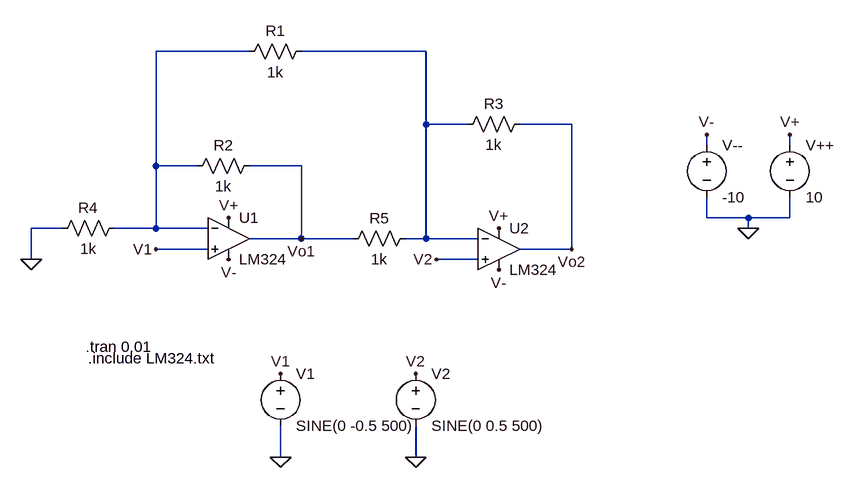
[diagram p0: schematic Lab1Circ1.asc]
Lab1Circ1.asc, the LTspice schematic file:
Version 4
SHEET 1 1424 680
WIRE 240 -128 96 -128
WIRE 512 -128 320 -128
WIRE 512 -16 512 -128
WIRE 576 -16 512 -16
WIRE 736 -16 656 -16
WIRE 944 16 944 0
WIRE 1072 16 1072 0
WIRE 96 48 96 -128
WIRE 160 48 96 48
WIRE 320 48 240 48
WIRE 944 128 944 96
WIRE 1008 128 944 128
WIRE 1072 128 1072 96
WIRE 1072 128 1008 128
WIRE -48 144 -96 144
WIRE 96 144 96 48
WIRE 96 144 32 144
WIRE 176 144 96 144
WIRE 1008 144 1008 128
WIRE 320 160 320 48
WIRE 320 160 240 160
WIRE 400 160 320 160
WIRE 512 160 512 -16
WIRE 512 160 480 160
WIRE 592 160 512 160
WIRE 176 176 96 176
WIRE 736 176 736 -16
WIRE 736 176 656 176
WIRE -96 192 -96 144
WIRE 592 192 528 192
WIRE 288 496 288 448
WIRE 496 496 496 448
FLAG 1008 144 0
FLAG -96 192 0
FLAG 1072 0 V+
FLAG 208 128 V+
FLAG 944 0 V-
FLAG 208 192 V-
FLAG 320 160 Vo1
FLAG 624 144 V+
FLAG 624 208 V-
FLAG 288 496 0
FLAG 496 496 0
FLAG 288 368 V1
FLAG 496 368 V2
FLAG 528 192 V2
FLAG 96 176 V1
FLAG 736 176 Vo2
SYMBOL AutoGenerated\\LM324 208 96 R0
SYMATTR InstName U1
SYMBOL voltage 1072 0 R0
WINDOW 123 0 0 Left 0
WINDOW 39 24 124 Left 2
SYMATTR InstName V++
SYMATTR Value 10
SYMBOL voltage 944 0 R0
WINDOW 123 0 0 Left 0
WINDOW 39 24 124 Left 2
SYMATTR InstName V--
SYMATTR Value -10
SYMBOL res 48 128 R90
WINDOW 0 0 56 VBottom 2
WINDOW 3 32 56 VTop 2
SYMATTR InstName R4
SYMATTR Value 1k
SYMBOL res 256 32 R90
WINDOW 0 0 56 VBottom 2
WINDOW 3 32 56 VTop 2
SYMATTR InstName R2
SYMATTR Value 1k
SYMBOL voltage 288 352 R0
WINDOW 123 24 124 Left 2
WINDOW 39 24 124 Left 2
SYMATTR InstName V1
SYMATTR Value SINE(0 -0.5 500)
SYMBOL res 496 144 R90
WINDOW 0 0 56 VBottom 2
WINDOW 3 32 56 VTop 2
SYMATTR InstName R5
SYMATTR Value 1k
SYMBOL res 336 -144 R90
WINDOW 0 0 56 VBottom 2
WINDOW 3 32 56 VTop 2
SYMATTR InstName R1
SYMATTR Value 1k
SYMBOL res 672 -32 R90
WINDOW 0 0 56 VBottom 2
WINDOW 3 32 56 VTop 2
SYMATTR InstName R3
SYMATTR Value 1k
SYMBOL AutoGenerated\\LM324 624 112 R0
SYMATTR InstName U2
SYMBOL voltage 496 352 R0
WINDOW 123 24 124 Left 2
WINDOW 39 24 124 Left 2
SYMATTR InstName V2
SYMATTR Value SINE(0 0.5 500)
TEXT -12 326 Left 2 !.tran 0.01
TEXT -8 344 Left 2 !.include LM324.txt

The netlist it stands for:
* Lab1Circ1.asc
* U1: LM324 (symbol AutoGenerated\LM324 not available, pins judged from their places): In+=V1 In-=N001 V+=V+ V-=V- OUT=Vo1
V++ V+ 0 10
V-- V- 0 -10
R4 N001 0 1k
R2 Vo1 N001 1k
V1 V1 0 SINE(0 -0.5 500)
R5 N002 Vo1 1k
R1 N002 N001 1k
R3 Vo2 N002 1k
* U2: LM324 (symbol AutoGenerated\LM324 not available, pins judged from their places): In+=V2 In-=N002 V+=V+ V-=V- OUT=Vo2
V2 V2 0 SINE(0 0.5 500)
.tran 0.01
.include LM324.txt
.backanno
.end